# EAGLE design cp_watch_rev_B (EAGLE 9.1.0)
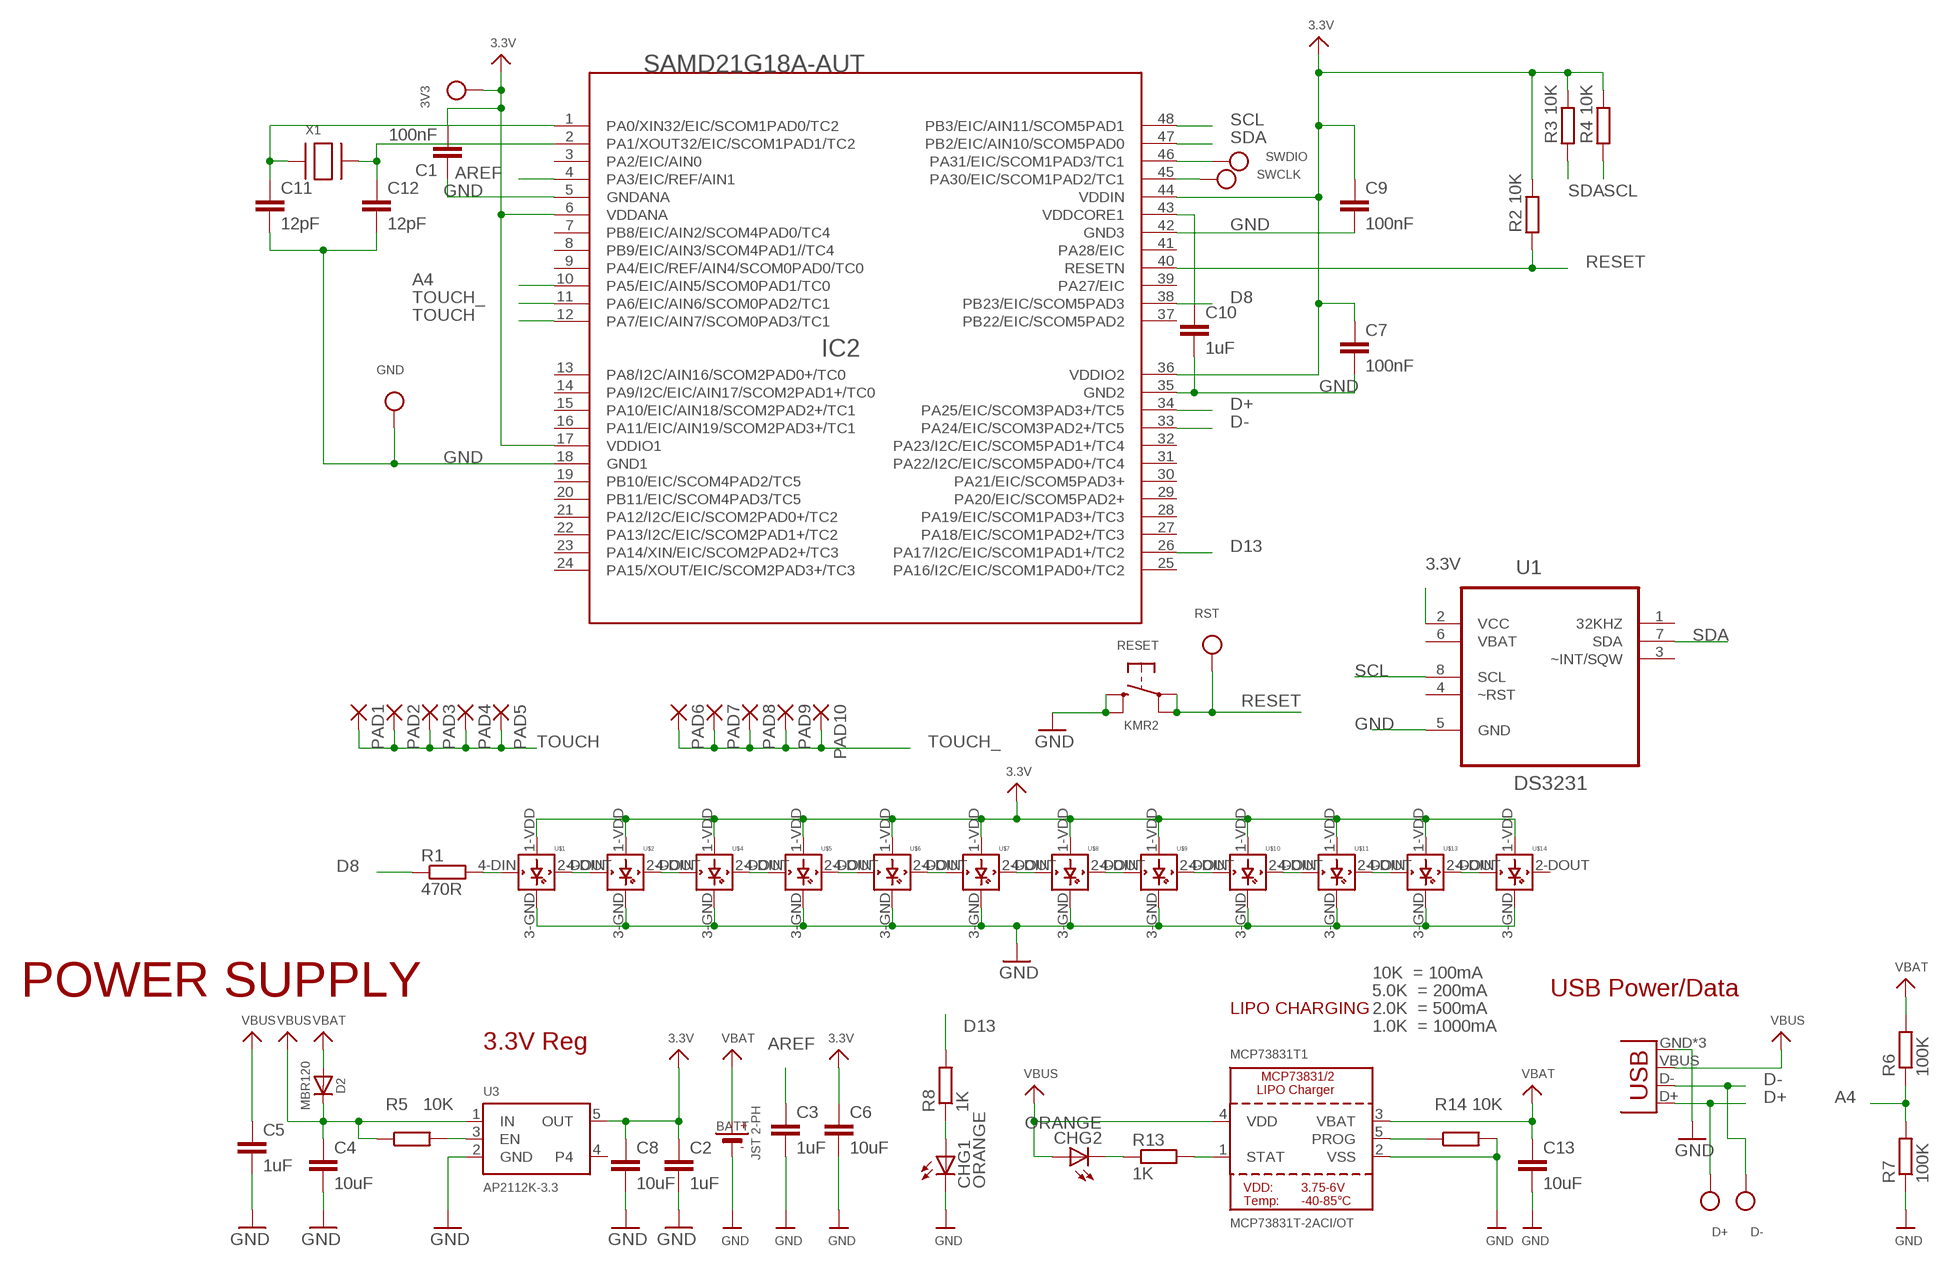
[diagram p0: schematic, sheet 1]

## Parts
3V3  TESTPOINTROUND1MM  [TESTPOINT_ROUND_1MM]
BATT  JST 2-PH  BATTERY  [JSTPH2]
C1  100nF  C-EUC0805  [C0805]
C2  1uF  C-EUC0805  [C0805]
C3  1uF  C-EUC0805  [C0805]
C4  10uF  C-EUC0805  [C0805]
C5  1uF  C-EUC0805  [C0805]
C6  10uF  C-EUC0805  [C0805]
C7  100nF  C-EUC0805  [C0805]
C8  10uF  C-EUC0805  [C0805]
C9  100nF  C-EUC0805  [C0805]
C10  1uF  C-EUC0805  [C0805]
C11  12pF  C-EUC0805  [C0805]
C12  12pF  C-EUC0805  [C0805]
C13  10uF  C-EUC0805  [C0805]
CHG1  ORANGE  LEDCHIPLED_0805  [CHIPLED_0805]
CHG2  ORANGE  LEDCHIPLED_0805  [CHIPLED_0805]
D2  MBR120  DIODESOD-123  [SOD-123]
D+  TESTPOINTROUND1MM  [TESTPOINT_ROUND_1MM]
D-  TESTPOINTROUND1MM  [TESTPOINT_ROUND_1MM]
GND  TESTPOINTROUND1MM  [TESTPOINT_ROUND_1MM]
IC2  SAMD21G18A-AUT  SAMD21G18A  [TQFP48]
MCP73831T1  MCP73831T-2ACI/OT  MCP73831/2  [SOT23-5]
PAD1  SMD5  [SMD2,54-5,08]
PAD2  SMD5  [SMD2,54-5,08]
PAD3  SMD5  [SMD2,54-5,08]
PAD4  SMD5  [SMD2,54-5,08]
PAD5  SMD5  [SMD2,54-5,08]
PAD6  SMD5  [SMD2,54-5,08]
PAD7  SMD5  [SMD2,54-5,08]
PAD8  SMD5  [SMD2,54-5,08]
PAD9  SMD5  [SMD2,54-5,08]
PAD10  SMD5  [SMD2,54-5,08]
R1  470R  R-EU_R0805  [R0805]
R2  10K  R-EU_R0805  [R0805]
R3  10K  R-EU_R0805  [R0805]
R4  10K  R-EU_R0805  [R0805]
R5  10K  R-EU_R0805  [R0805]
R6  100K  R-EU_R0805  [R0805]
R7  100K  R-EU_R0805  [R0805]
R8  1K  R-EU_R0805  [R0805]
R13  1K  R-EU_R0805  [R0805]
R14  10K  R-EU_R0805  [R0805]
RESET  KMR2  SWITCH_TACT_SMT4.6X2.8  [BTN_KMR2_4.6X2.8]
RST  TESTPOINTROUND1MM  [TESTPOINT_ROUND_1MM]
SWCLK  TESTPOINTROUND1MM  [TESTPOINT_ROUND_1MM]
SWDIO  TESTPOINTROUND1MM  [TESTPOINT_ROUND_1MM]
U1  DS3231  DS3231MZ+  [SOIC8_150MIL]
U3  AP2112K-3.3  AP2112K-3.3_  [SOT95P290X120-5]
U$1  WS2812B  [WS2812B]
U$2  WS2812B  [WS2812B]
U$4  WS2812B  [WS2812B]
U$5  WS2812B  [WS2812B]
U$6  WS2812B  [WS2812B]
U$7  WS2812B  [WS2812B]
U$8  WS2812B  [WS2812B]
U$9  WS2812B  [WS2812B]
U$10  WS2812B  [WS2812B]
U$11  WS2812B  [WS2812B]
U$13  WS2812B  [WS2812B]
U$14  WS2812B  [WS2812B]
USB  USB_MICRO_ATTEND_  [USB_MICRO]
X1  XTALNX5032  [NX5032]

## Nets
3.3V: 3V3.P$1 C1.2 C2.1 C6.1 C7.1 C8.1 C9.1 IC2.6(VDDANA) IC2.17(VDDIO1) IC2.36(VDDIO2) IC2.44(VDDIN) R2.2 R3.2 R4.2 U1.2(VCC) U3.5(OUT) U$1.1-VDD(VDD) U$2.1-VDD(VDD) U$4.1-VDD(VDD) U$5.1-VDD(VDD) U$6.1-VDD(VDD) U$7.1-VDD(VDD) U$8.1-VDD(VDD) U$9.1-VDD(VDD) U$10.1-VDD(VDD) U$11.1-VDD(VDD) U$13.1-VDD(VDD) U$14.1-VDD(VDD)
A4: IC2.10(PA5/EIC/AIN5/SCOM0PAD1/TC0) R6.1 R7.2
AREF: C3.1 IC2.4(PA3/EIC/REF/AIN1)
D8: IC2.38(PB23/EIC/SCOM5PAD3) R1.1
D13: IC2.26(PA17/I2C/EIC/SCOM1PAD1+/TC2) R8.2
D+: D+.P$1 IC2.34(PA25/EIC/SCOM3PAD3+/TC5) USB.D+
D-: D-.P$1 IC2.33(PA24/EIC/SCOM3PAD2+/TC5) USB.D-
GND: BATT.1(-) C1.1 C2.2 C3.2 C4.2 C5.2 C6.2 C7.2 C8.2 C9.2 C10.2 C11.2 C12.2 C13.2 CHG1.C GND.P$1 IC2.5(GNDANA) IC2.18(GND1) IC2.35(GND2) IC2.42(GND3) MCP73831T1.2(VSS) R7.1 R14.2 RESET.B'(S1) RESET.B(S) U1.5(GND) U3.2(GND) U$1.3-GND(GND) U$2.3-GND(GND) U$4.3-GND(GND) U$5.3-GND(GND) U$6.3-GND(GND) U$7.3-GND(GND) U$8.3-GND(GND) U$9.3-GND(GND) U$10.3-GND(GND) U$11.3-GND(GND) U$13.3-GND(GND) U$14.3-GND(GND) USB.GND USB.GND@2(GND) USB.GND@3(GND)
N$1: C11.1 IC2.1(PA0/XIN32/EIC/SCOM1PAD0/TC2) X1.P$1
N$2: IC2.45(PA30/EIC/SCOM1PAD2/TC1) SWCLK.P$1
N$3: R5.2 U3.3(EN)
N$4: R1.2 U$1.4-DIN(DIN)
N$5: C10.1 IC2.43(VDDCORE1)
N$6: U$1.2-DOUT(DOUT) U$2.4-DIN(DIN)
N$7: C12.1 IC2.2(PA1/XOUT32/EIC/SCOM1PAD1/TC2) X1.P$2
N$8: U$2.2-DOUT(DOUT) U$4.4-DIN(DIN)
N$9: U$4.2-DOUT(DOUT) U$5.4-DIN(DIN)
N$10: U$5.2-DOUT(DOUT) U$6.4-DIN(DIN)
N$11: U$6.2-DOUT(DOUT) U$7.4-DIN(DIN)
N$12: U$7.2-DOUT(DOUT) U$8.4-DIN(DIN)
N$13: U$8.2-DOUT(DOUT) U$9.4-DIN(DIN)
N$14: U$9.2-DOUT(DOUT) U$10.4-DIN(DIN)
N$15: U$10.2-DOUT(DOUT) U$11.4-DIN(DIN)
N$16: U$11.2-DOUT(DOUT) U$13.4-DIN(DIN)
N$17: U$13.2-DOUT(DOUT) U$14.4-DIN(DIN)
N$18: CHG1.A R8.1
N$23: CHG2.C R13.1
N$27: MCP73831T1.1(STAT) R13.2
N$28: MCP73831T1.5(PROG) R14.1
RESET: IC2.40(RESETN) R2.1 RESET.A'(P1) RESET.A(P) RST.P$1
SCL: IC2.48(PB3/EIC/AIN11/SCOM5PAD1) R4.1 U1.8(SCL)
SDA: IC2.47(PB2/EIC/AIN10/SCOM5PAD0) R3.1 U1.7(SDA)
SWDIO: IC2.46(PA31/EIC/SCOM1PAD3/TC1) SWDIO.P$1
TOUCH: IC2.12(PA7/EIC/AIN7/SCOM0PAD3/TC1) PAD1.1(P) PAD2.1(P) PAD3.1(P) PAD4.1(P) PAD5.1(P)
TOUCH_: IC2.11(PA6/EIC/AIN6/SCOM0PAD2/TC1) PAD6.1(P) PAD7.1(P) PAD8.1(P) PAD9.1(P) PAD10.1(P)
VBAT: BATT.2(+) C13.1 D2.A MCP73831T1.3(VBAT) R6.2
VBUS: C4.1 C5.1 CHG2.A D2.C MCP73831T1.4(VDD) R5.1 U3.1(IN) USB.VBUS
Unconnected: IC2.3(PA2/EIC/AIN0) IC2.7(PB8/EIC/AIN2/SCOM4PAD0/TC4) IC2.8(PB9/EIC/AIN3/SCOM4PAD1//TC4) IC2.9(PA4/EIC/REF/AIN4/SCOM0PAD0/TC0) IC2.13(PA8/I2C/AIN16/SCOM2PAD0+/TC0) IC2.14(PA9/I2C/EIC/AIN17/SCOM2PAD1+/TC0) IC2.15(PA10/EIC/AIN18/SCOM2PAD2+/TC1) IC2.16(PA11/EIC/AIN19/SCOM2PAD3+/TC1) IC2.19(PB10/EIC/SCOM4PAD2/TC5) IC2.20(PB11/EIC/SCOM4PAD3/TC5) IC2.21(PA12/I2C/EIC/SCOM2PAD0+/TC2) IC2.22(PA13/I2C/EIC/SCOM2PAD1+/TC2) IC2.23(PA14/XIN/EIC/SCOM2PAD2+/TC3) IC2.24(PA15/XOUT/EIC/SCOM2PAD3+/TC3) IC2.25(PA16/I2C/EIC/SCOM1PAD0+/TC2) IC2.27(PA18/EIC/SCOM1PAD2+/TC3) IC2.28(PA19/EIC/SCOM1PAD3+/TC3) IC2.29(PA20/EIC/SCOM5PAD2+) IC2.30(PA21/EIC/SCOM5PAD3+) IC2.31(PA22/I2C/EIC/SCOM5PAD0+/TC4) IC2.32(PA23/I2C/EIC/SCOM5PAD1+/TC4) IC2.37(PB22/EIC/SCOM5PAD2) IC2.39(PA27/EIC) IC2.41(PA28/EIC) U1.1(32KHZ) U1.3(~INT/SQW) U1.4(~RST) U3.4 U$14.2-DOUT(DOUT)

## Notes on the sheet
- 10K  = 100mA
- POWER SUPPLY | 5.0K  = 200mA | USB Power/Data
- LIPO CHARGING | 2.0K  = 500mA
- 1.0K  = 1000mA
- 3.3V Reg

## Power pins joined to a net without a drawn wire
VBAT: U1.6(VBAT)

## Library data of the parts
3V3 D+ D- GND RST SWCLK SWDIO = microbuilder:TESTPOINT: Test Point Various test points for characterisation and PCB testing TESTPOINT_SMT - Compact Surface Mount Test Point [Digikey: 5016KTR-ND]
BATT = microbuilder:BATTERY: CR1220 SMT - Digikey: 3001K-ND
C1-C13 = rcl:C-EU: CAPACITOR, European symbol; SPICEPREFIX: C
CHG1 CHG2 = led:LED: LED OSRAM: - CHIPLED LG R971, LG N971, LY N971, LG Q971, LY Q971, LO R971, LY R971 LH N974, LH R974 LS Q976, LO Q976, LY Q976 LO Q996 - Hyper CHIPLED LW Q18S LB Q993, LB Q99A, LB R99A - SideLED LS A670, LO A670, LY A670, LG A670, LP A670 LB A673, LV A673, LT A673, LW A673 LH A674 LY A675 LS A676, LA A676, LO A676, LY A676, LW A676 LS A679, LY A679, LG A679 - Hyper Micro SIDELED® LS Y876, LA Y876, LO Y876, LY Y876 LT Y87S - SmartLED LW L88C, LW L88S LB L89C, LB L89S, LG L890 LS L89K, LO L89K, LY L89K LS L896, LA L896, LO L896, LY L896 - TOPLED LS T670, LO T670, LY T670, LG T670, LP T670 LSG T670, LSP T670, LSY T670, LOP T670, LYG T670 LG T671, LOG T671, LSG T671 LB T673, LV T673, LT T673, LW T673 LH T674 LS T676, LA T676, LO T676, LY T676, LB T676, LH T676, LSB T676, LW T676 LB T67C, LV T67C, LT T67C, LS T67K, LO T67K, LY T67K, LW E67C LS E67B, LA E67B, LO E67B, LY E67B, LB E67C, LV E67C, LT E67C LW T67C LS T679, LY T679, LG T679 LS T770, LO T770, LY T770, LG T770, LP T770 LB T773, LV T773, LT T773, LW T773 LH T774 LS E675, LA E675, LY E675, LS T675 LS T776, LA T776, LO T776, LY T776, LB T776 LHGB T686 LT T68C, LB T68C - Hyper Mini TOPLED® LB M676 - Mini TOPLED Santana® LG M470 LS M47K, LO M47K, LY M47K Source: http://www.osram.convergy.de LUXEON: - LUMILED® LXK2-PW12-R00, LXK2-PW12-S00, LXK2-PW14-U00, LXK2-PW14-V00 LXK2-PM12-R00, LXK2-PM12-S00, LXK2-PM14-U00 LXK2-PE12-Q00, LXK2-PE12-R00, LXK2-PE12-S00, LXK2-PE14-T00, LXK2-PE14-U00 LXK2-PB12-K00, LXK2-PB12-L00, LXK2-PB12-M00, LXK2-PB14-N00, LXK2-PB14-P00, LXK2-PB14-Q00 LXK2-PR12-L00, LXK2-PR12-M00, LXK2-PR14-Q00, LXK2-PR14-R00 LXK2-PD12-Q00, LXK2-PD12-R00, LXK2-PD12-S00 LXK2-PH12-R00, LXK2-PH12-S00 LXK2-PL12-P00, LXK2-PL12-Q00, LXK2-PL12-R00 Source: www.luxeon.com KINGBRIGHT: KA-3528ASYC Source: www.kingbright.com
D2 = microbuilder:DIODE: Diode SMA Model Volts Amps Type Vf Ir Digikey # Notes SSA34-E3 40V 3A Schottky 480mV @ 3A 200uA @ 40V SSA34-E3/61TGITR-ND CDBA120-G 20V 1A Schottky 500mV @ 1A 500uA @ 20V 641-1014-6-ND REEL MBRA210 10V 2A Schottky 350mV @ 2A 700uA @ 10V MBRA210LT3 SOD-123 Model Volts Amps Type Vf Ir Order # Notes BAT54T1G 30V 200mA Schottky 800mV @ 200mA 2uA @ 25V BAT54T1GOSTR-ND B0530W 30V 500mA Schottky 430mV @ 500mA 130uA @ 30V B0530W-FDICT-ND REEL MBR120 20V 1A Schottky 340mV @ 1A MBR120VLSFT1GOSCT-ND SOD-323 Model Volts Amps Type Vf Ir Order # Notes PMEG2005EJ 20V 500mA Schottky 355mV @ 500mA 568-4110-1-ND ZLLS410 10V 570mA Schottky 380mV @ 570mA ZLLS410CT-ND 1N4148WS 75V 150mA Silicon/Simple 1V 1N4148WSFSCT-ND REEL SOD-523 Model Volts Amps Type Vf Ir Order # Notes BAT54XV2 30V 200mA Schottky 0.8V @ 100mA BAT54XV2CT-ND TB751S 30V 30mA Schottky RB751S-40TE61CT-ND SOT23-R/W (R = Solder Paste/Reflow Ovens, W = Hand-Soldering) Model Volts Amps Type Vf Ir Order # Notes BAT54FILM 40V 300mA Schottky 497-7162-1-ND POWERDI-5 Model Volts Amps Type Vf Ir Order # Notes PDS560 60V 5A Schottky 670mV @ 5A 150uA @ 60V PDS560DICT-ND
IC2 = Arduino:SAMD21G18A: Atmel D21 32bit ARM Cortex-M0 microcontroller - 48 PIN TQFP 256KB flash memory + 32KB SRAM
MCP73831T1 = microbuilder:MCP73831/2: MCP73831/2 LIPO Charger VDD: 3.75 - 6V Temp -40 - 85°C Programmable Charge Rate: 15-500mA NOTE: STAT is a tri-state logic output on the MCP73831 and an open-drain output on the MCP73832. SOT23-5 with 4.2V output and tri-state logic on STAT = MCP73831T-2ACI/OT
PAD1-PAD10 = wirepad:SMD5: SMD PAD
R1-R8 R13 R14 = rcl:R-EU_: RESISTOR, European symbol; SPICEPREFIX: R
RESET = microbuilder:SWITCH_TACT_SMT: SMT Tact Switches 6x6mm - Digikey: P12940SCT-ND KMR2 (4.6x2.8mm) - Digikey: 401-1426-1-ND EVQ-PQHB55 - Light Touch, 160GF (4.5x4.5mm) - Digikey: P8090SCT-ND KMT0 - KMT021 NGJ LHS (etc.) IP68/Waterproof - Digikey: CKN10289CT-ND
U1 = zak:DS3231MZ+
U3 = dronecz:AP2112K-3.3
U$1 U$2 U$4-U$11 U$13 U$14 = dronecz:WS2812B
USB = dronecz:USB_MICRO_ATTEND: https://www.tme.eu/cz/Document/1cbb1fe1d020818ecbe0fffe16726397/207A-BBA0-R.pdf
X1 = adafruit:XTAL: Low cost SMT crystals, no capacitors included http://www.ladyada.net/library/eagle

## Net classes
1 vcc: width 0.203 mm, drill 0.356 mm, clearance 0.203 mm
2 GND: width 0.203 mm, drill 0.356 mm, clearance 0.203 mm

## Board
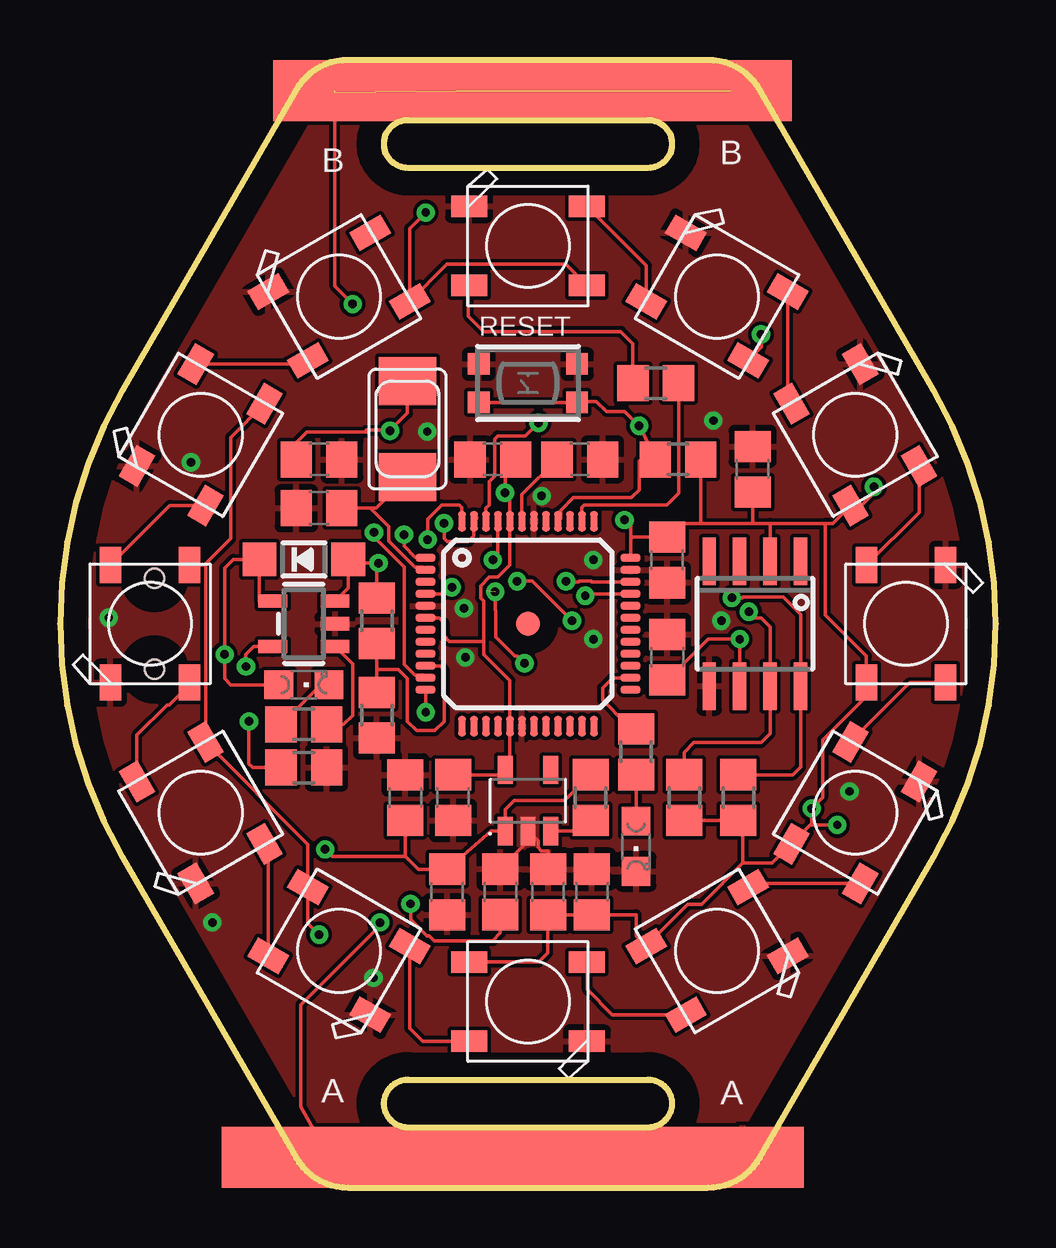
[diagram p1: board, top side]
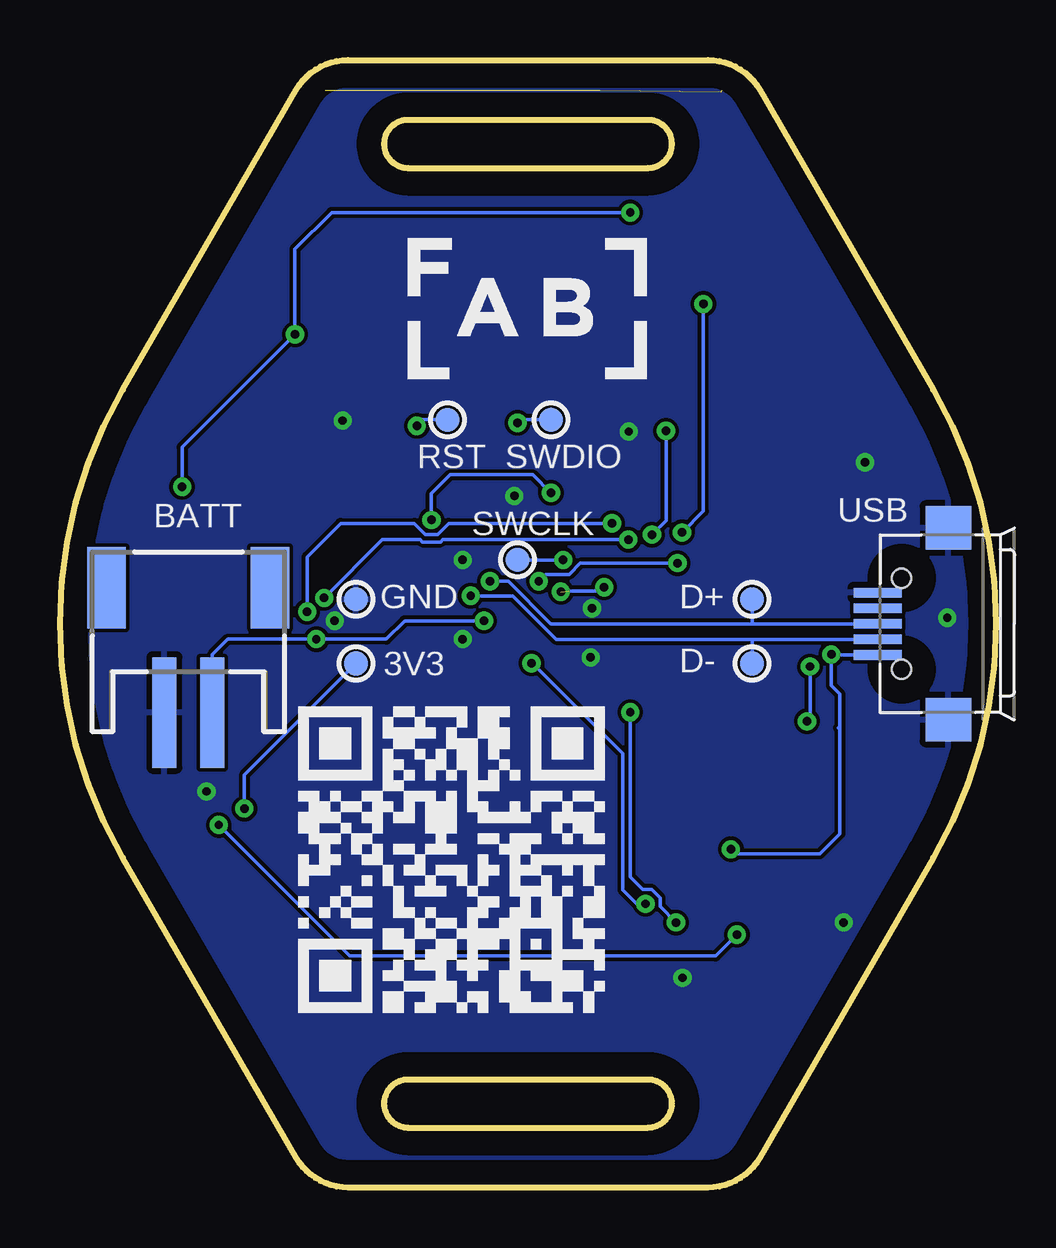
[diagram p2: board, bottom side, seen from below]

Size 39 x 47 mm. Coordinates in mm from the lower left corner, seen from the top.
Outline: 12,47 arc60 9.83,45.75 2.62,33.26 arc60 2.62,13.74 9.83,1.25 arc60 12,0 27,0 arc60 29.16,1.25 36.38,13.74 arc60 36.38,33.26 29.16,45.75 arc60 27,47 12,47
Outline: 24.5,42.5 14.5,42.5 arc-180 14.5,44.5 24.5,44.5 arc-180 24.5,42.5
Outline: 24.5,4.5 arc-180 24.5,2.5 14.5,2.5 arc-180 14.5,4.5 24.5,4.5
Copper layers (1*16): Top 0.035mm / dielectric 1.5mm / Bottom 0.035mm
Design rules "default": minimum track width 6mil, minimum drill 0.35mm, track to track 6mil, track to pad 6mil, pad to pad 6mil, via to via 6mil, smd to smd 6mil, copper to edge 40mil, drill to drill 6mil, minimum pad ring 10mil, minimum via ring 8mil, stop-mask expansion 4mil, vias tented up to drill 0mil, thermal gap 10mil

### Footprints (pad centres in the part's own frame; a part is rotated, then mirrored left to right if it is on the bottom)
TESTPOINT_ROUND_1MM = smd 1 x 1: P$1 0,0
JSTPH2 = smd 1 x 4.6: 1 -1,-3.7; 2 1,-3.7 | smd 1.6 x 3.4: NC1 -3.4,1.5; NC2 3.4,1.5
C0805 = smd 1.3 x 1.5: 1 -0.95,0; 2 0.95,0
CHIPLED_0805 = smd 1.2 x 1.2: A 0,-1.05; C 0,1.05
SOD-123 = smd 1.4 x 1.4: A 1.85,0; C -1.85,0
TQFP48 = smd 0.85 x 0.32: 1 -4.275,2.75; 2 -4.275,2.25; 3 -4.275,1.75; 4 -4.275,1.25; 5 -4.275,0.75; 6 -4.275,0.25; 7 -4.275,-0.25; 8 -4.275,-0.75; 9 -4.275,-1.25; 10 -4.275,-1.75; 11 -4.275,-2.25; 12 -4.275,-2.75; 25 4.275,-2.75; 26 4.275,-2.25; 27 4.275,-1.75; 28 4.275,-1.25; 29 4.275,-0.75; 30 4.275,-0.25; 31 4.275,0.25; 32 4.275,0.75; 33 4.275,1.25; 34 4.275,1.75; 35 4.275,2.25; 36 4.275,2.75 | smd 0.32 x 0.85: 13 -2.75,-4.275; 14 -2.25,-4.275; 15 -1.75,-4.275; 16 -1.25,-4.275; 17 -0.75,-4.275; 18 -0.25,-4.275; 19 0.25,-4.275; 20 0.75,-4.275; 21 1.25,-4.275; 22 1.75,-4.275; 23 2.25,-4.275; 24 2.75,-4.275; 37 2.75,4.275; 38 2.25,4.275; 39 1.75,4.275; 40 1.25,4.275; 41 0.75,4.275; 42 0.25,4.275; 43 -0.25,4.275; 44 -0.75,4.275; 45 -1.25,4.275; 46 -1.75,4.275; 47 -2.25,4.275; 48 -2.75,4.275 | smd 1 x 1: P$1 0,0
SOT23-5 = smd 0.55 x 1.2: 1 -0.95,-1.3; 2 0,-1.3; 3 0.95,-1.3; 4 0.95,1.3; 5 -0.95,1.3
SMD2,54-5,08 = smd 2.54 x 5.08: 1 0,0
R0805 = smd 1.3 x 1.5: 1 -0.95,0; 2 0.95,0
BTN_KMR2_4.6X2.8 = smd 0.9 x 0.9: A 2.05,0.8; A' -2.05,0.8; B 2.05,-0.8; B' -2.05,-0.8
SOIC8_150MIL = smd 0.559 x 1.981: 1 -1.905,-2.6; 2 -0.635,-2.6; 3 0.635,-2.6; 4 1.905,-2.6; 5 1.905,2.6; 6 0.635,2.6; 7 -0.635,2.6; 8 -1.905,2.6
SOT95P290X120-5 = smd 1.18 x 0.609: 1 -1.274,0.95; 2 -1.274,0; 3 -1.274,-0.95; 4 1.274,-0.95; 5 1.274,0.95
WS2812B = smd 1.5 x 0.9: 1-VDD 2.45,-1.65; 2-DOUT 2.45,1.65; 3-GND -2.45,1.65; 4-DIN -2.45,-1.65
USB_MICRO = smd 0.4 x 2: D+ 0,3.1; D- -0.65,3.1; GND 1.3,3.1; ID 0.65,3.1; VBUS -1.3,3.1 | smd 1.8 x 1.9: GND@2 -4,0.15; GND@3 4,0.15 | hole 0.8: -1.9,2.1; 1.9,2.1
NX5032 = smd 2 x 2.4: P$1 2,0; P$2 -2,0

### Placement (x,y rotation side)
3V3  26.67,21.84 0 bottom
BATT  33.65,23.5 0 bottom
C1  16.38,16.26 90 top
C2  28.86,29.94 90 top
C3  18.35,12.32 90 top
C4  16.13,12.32 270 top
C5  14.39,16.25 90 top
C6  20.34,12.32 90 top
C7  25.29,26.16 270 top
C8  22.16,12.32 90 top
C9  18.03,30.35 180 top
C10  21.66,30.35 0 top
C11  10.79,30.35 0 top
C12  10.79,28.32 180 top
C13  25.3,22.1 90 top
CHG1  24,14.22 180 top
CHG2  10.16,20.95 270 top
D2  10.16,26.18 0 top
D+  10.16,24.51 0 bottom
D-  10.16,21.84 0 bottom
GND  26.67,24.51 0 bottom
IC2  19.5,23.5 0 top
MCP73831T1  10.16,23.5 90 top
PAD1  9.27,1.27 270 top
PAD2  14.35,1.27 90 top
PAD3  23.37,1.27 90 top
PAD4  28.45,1.27 90 top
PAD5  18.41,1.27 90 top
PAD6  27.94,45.72 90 top
PAD7  24.13,45.72 90 top
PAD8  20.32,45.72 90 top
PAD9  16.51,45.72 90 top
PAD10  11.43,45.72 90 top
R1  24.82,33.53 180 top
R2  25.75,30.35 0 top
R3  26.01,16.26 270 top
R4  28.27,16.26 270 top
R5  22.11,16.26 270 top
R6  13.21,23.62 90 top
R7  13.21,19.68 90 top
R8  24,18.16 90 top
R13  10.16,19.3 0 top
R14  10.16,17.5 0 top
RESET  19.5,33.53 180 top
RST  22.86,32 0 bottom
SWCLK  19.94,26.16 0 bottom
SWDIO  18.54,32 0 bottom
U1  28.96,23.5 180 top
U3  19.5,16.13 90 top
U$1  19.5,39.25 0 top
U$2  27.37,37.14 330 top
U$4  33.14,31.37 300 top
U$5  35.25,23.5 270 top
U$6  33.14,15.63 240 top
U$7  27.37,9.86 210 top
U$8  19.5,7.75 180 top
U$9  11.63,9.86 150 top
U$10  5.86,15.63 120 top
U$11  3.75,23.5 90 top
U$13  5.86,31.37 60 top
U$14  11.63,37.14 30 top
USB  1.83,23.5 90 bottom
X1  14.48,31.62 90 top

### Tracks (layer width: path | path; a pad name or v marks a point on that pad's centre or on a via)
3.3V  (via drill 0.35)
  Top 0.152: 24.36,10.13 24,10.49 24,11.37 C8.1 C6.1 20.46,11.37 20.32,11.37 | 24.36,10.13 U$7.1-VDD | 31.88,27.69 32.19,27.69 U$4.1-VDD 33.38,28.43 33.91,28.96 v33.91,29.21 | 31.88,27.69 31.88,23.87 33.6,22.15 U$5.1-VDD 33.6,20.47 31.78,18.65 31.78,16.26 v31.32,15.8 31.32,15.16 31.27,15.11 | U$7.1-VDD | U$11.1-VDD 6.01,25.95 6.07,26 | 6.07,26 7.11,27.05 7.11,31.27 U$13.1-VDD | 6.07,26 6.07,21.91 6.08,21.89 6.08,20.2 6.07,20.19 U$10.1-VDD 10.33,14.31 U$9.1-VDD 10.33,11.01 v10.79,10.54 | 22.22,37.33 U$1.1-VDD 21.07,38.48 16.12,38.48 U$14.1-VDD 14.57,39.97 v15.24,40.64 | 24.64,27.11 C7.1 | C7.1 23.86,27.11 23.79,27.05 23.77,27.05 | C7.1 25.87,27.69 26.67,27.69 | 26.67,27.69 28.82,27.69 | 28.82,27.69 29.59,27.69 | 29.59,27.69 31.88,27.69 | U1.2 29.59,27.69 | U$2.1-VDD 29.21,35.02 v29.21,35.56 | 31.27,15.11 U$6.1-VDD 29.68,13.53 28.44,13.53 | 20.26,11.37 20.32,11.37 | 28.44,13.53 26.73,11.81 26.16,11.81 U$7.1-VDD | C1.2 18.35,17.21 U3.5 18.75,17.6 IC2.17 18.75,21.13 17.65,22.23 17.65,22.77 | IC2.36 23.77,27.05 | 23.77,27.05 23.77,27.57 v23.52,27.83 | C9.1 18.54,29.91 v18.54,28.96 18.75,28.75 IC2.44 18.75,25.95 18.23,25.44 17.88,25.44 17.53,25.08 17.53,24.58 17.65,24.45 17.65,22.77 | 28.44,13.53 28.44,15.13 R4.2 R3.2 | 24.38,10.16 24.36,10.13 | v32.38,15.11 31.27,15.11 | IC2.6 15.79,23.75 16,23.54 16,22.99 16.22,22.77 17.65,22.77 | U$8.1-VDD 19.94,9.4 20.32,9.78 20.32,11.37 | R2.2 26.7,27.71 26.67,27.69 | C2.1 28.86,27.73 28.82,27.69
  Bottom 0.152: v33.91,29.21 33.91,30.86 v29.21,35.56 29.21,39.12 27.69,40.64 v15.24,40.64 | v31.32,15.8 31.32,17.19 3V3.P$1 | v10.79,10.54 11.68,9.65 26.92,9.65 v32.38,15.11 | v23.52,27.83 23.52,28.93 22.73,29.72 19.3,29.72 v18.54,28.96
A4
  Top 0.152: IC2.10 15.84,21.75 16,21.59 16,19.43 15.62,19.05 14.86,19.05 14.48,19.43 14.48,21.21 14.1,21.59 13.21,21.59 | 13.21,21.59 R6.1 | R7.2 13.21,21.59
AREF  (via drill 0.35)  (1 unrouted)
  Top 0.152: C3.1 18.35,10.61 18.03,10.29 15.59,10.29 15.39,10.49 15.28,10.49 14.6,11.17 v14.6,11.82 | IC2.4 16.06,24.75 v16.33,25.02 | v19.36,21.85 19.05,22.15 18.94,22.15 18.15,22.94 18.15,24.06 18.13,24.08 v18.13,24.83
  Bottom 0.152: v19.36,21.85 19.31,21.85 15.54,18.09 15.54,12.4 14.97,11.82 v14.6,11.82 | 17.81,24.86 16.49,24.86 v16.33,25.02
D8
  Top 0.152: IC2.38 21.75,28.35 21.84,28.45 25.27,28.45 25.78,28.96 R1.1
D13
  Top 0.152: R8.2 23.56,19.36 22.61,20.32 22.61,20.83 23.03,21.25 IC2.26
D+  (via drill 0.35)
  Top 0.152: v21.08,25.27 21.1,25.25 21.61,25.25 21.64,25.27 22.14,25.27 22.16,25.25 IC2.34
  Bottom 0.152: USB.D+ 10.16,23.5 | 10.16,23.5 18.55,23.5 20.32,25.27 v21.08,25.27 | D+.P$1 10.16,23.5
D-  (via drill 0.35)
  Top 0.152: IC2.33 21.97,24.75 v21.89,24.67
  Bottom 0.152: USB.D- 10.16,22.85 | 10.16,22.85 18.33,22.85 20.14,24.67 v21.89,24.67 | D-.P$1 10.16,22.85
GND  (via drill 0.35)
  Top 0.152: C6.2 20.34,14.02 20.32,14.04 20.05,14.04 19.92,14.17 19.92,14.44 U3.2 19.5,14.42 C3.2
  other vias: 22.22,22.86 32.89,16.51 27.22,31.97 5.46,30.23 16.84,24.15 15.3,31.51 2.03,23.75 16.89,22.1 20.07,28.83 27.56,23.62 22.22,26.16 6.35,11.05 13.06,8.74
  pour Top (rank 2): 0,0 39.37,0 39.37,46.99 0,46.99
  pour Bottom (rank 2): 0,0 39.37,0 39.37,46.99 0,46.5
N$1  (via drill 0.35)
  Top 0.152: 14.45,33.66 X1.P$1 14.48,32.27 v13.75,31.54 13.82,31.57 12.77,31.57 12.7,31.5 | 12.7,31.5 10.29,31.5 9.84,31.05 C11.1 | 12.7,31.5 12.83,31.5 | IC2.1 15.19,26.29 14.78,26.29 14.34,26.74 v14.34,27.21
  Bottom 0.152: v14.34,27.21 13.75,27.8 v13.75,31.54
N$2  (via drill 0.35)
  Top 0.152: v18.03,26.16 18.25,26.38 IC2.45
  Bottom 0.152: SWCLK.P$1 v18.03,26.16
N$3
  Top 0.152: U3.3 21.66,14.85 R5.2
N$4
  Top 0.152: R1.2 23.87,35.18 23.37,35.69 17.65,35.69 17.02,36.32 17.02,37.57 U$1.4-DIN
N$5
  Top 0.152: 20.83,29.84 20.71,29.96 C10.1 19.25,28.89 IC2.43 19.25,27.94
N$6
  Top 0.152: U$2.4-DIN 24.43,38.42 U$1.2-DOUT
N$7
  Top 0.152: IC2.2 15.11,25.86 14.78,25.86 13.69,26.95 13.69,27.56 12.92,28.32 | 12.92,28.32 11.94,28.32 C12.1 | X1.P$2 13.18,28.32 12.92,28.32
N$8
  Top 0.152: U$4.4-DIN 30.32,32.83 U$2.2-DOUT
N$9
  Top 0.152: U$5.4-DIN 35.79,28.14 U$4.2-DOUT
N$10
  Top 0.152: U$6.4-DIN 35.41,21.05 U$5.2-DOUT
N$11
  Top 0.152: U$7.4-DIN 28.83,12.68 U$6.2-DOUT
N$12
  Top 0.152: U$7.2-DOUT 23.02,7.21 21.97,8.26 21.97,9.38 U$8.4-DIN
N$13
  Top 0.152: U$8.2-DOUT 15.11,6.1 14.57,6.64 U$9.4-DIN
N$14
  Top 0.152: U$9.2-DOUT 8.68,14.17 U$10.4-DIN
N$15
  Top 0.152: U$10.2-DOUT 3.21,18.86 4.46,20.11 4.55,20.11 5.4,20.96 U$11.4-DIN 5.08,21.37 5.08,21.59
N$16
  Top 0.152: U$11.2-DOUT 4.58,28.43 U$13.4-DIN
N$17
  Top 0.152: U$14.4-DIN 10.17,34.32 U$13.2-DOUT
N$18
  Top 0.152: R8.1 CHG1.A
N$23
  Top 0.152: R13.1 10.86,20.95 CHG2.C
N$27
  Top 0.152: R13.2 11.81,19.3 12.19,19.68 12.19,21.82 MCP73831T1.1
N$28  (via drill 0.35)
  Top 0.152: 8.86,22.34 MCP73831T1.5 8.07,22.55 7.75,22.23 v7.75,21.72 | 8.02,19.28 8,19.3 | 8,19.3 v7.87,19.43 | R14.1 8.02,17.5 7.87,17.65 7.87,19.18 8,19.3
  Bottom 0.152: v7.87,19.43 7.75,19.56 v7.75,21.72
RESET  (via drill 0.35)
  Top 0.152: RESET.A RESET.A' | RESET.A' 21.59,32.35 | IC2.40 20.86,27.89 20.86,28.22 21.39,28.75 23.8,28.75 24.13,29.08 24.13,30.28 R2.1 24.2,31.68 v24.13,31.75 23.53,32.35 22.77,32.35 22.35,32.77 21.59,32.77 RESET.A'
  Bottom 0.152: RST.P$1 23.88,32 v24.13,31.75
SCL  (via drill 0.35)
  Top 0.152: v27.99,24.58 28.42,24.58 28.45,24.61 30.13,24.61 30.86,23.88 30.86,20.95 U1.8 30.86,17.53 30.54,17.21 R4.1 | IC2.48 16.75,28.34 16.64,28.45 15.91,28.45 15.32,27.86 v15.32,27.01
  Bottom 0.152: 15.45,26.97 v15.32,27.01 23.05,27.01 23.14,26.92 23.9,26.92 23.99,27.01 25.57,27.01 v27.99,24.58
SDA  (via drill 0.35)
  Top 0.152: v28.7,24 28.96,23.75 29.21,23.75 29.59,23.37 U1.7 29.59,18.92 29.21,18.54 26.42,18.54 26.01,18.14 R3.1 | 17.36,27.94 17.36,27.89 IC2.47 17.25,27.16 17.02,26.92 16.13,26.92 16,27.05 v16,27.69
  Bottom 0.152: v28.7,24 28.7,26.29 27.3,27.69 24.24,27.69 23.77,27.22 23.27,27.22 22.8,27.69 v16,27.69
SWDIO  (via drill 0.35)
  Top 0.152: IC2.46 17.75,28.32 17.88,28.45 17.88,29.42 18.1,29.65 18.1,31.19 18.24,31.33 19.39,31.33 v19.94,31.88
  Bottom 0.152: SWDIO.P$1 19.56,32 19.68,31.88 v19.94,31.88
TOUCH  (via drill 0.35)
  Top 0.152: PAD1.1 14.33,1.27 | PAD4.1 PAD3.1 21.58,1.28 13.97,1.28 | 13.97,1.28 12.92,1.28 14.33,1.27 | 14.33,1.27 PAD2.1 | 10.92,1.83 10.03,3.35 10.03,7.62 13.33,10.92 v13.33,11.05 | 10.92,1.83 10.93,1.81 | IC2.12 15.18,20.7 15.24,20.64 v15.24,19.81 | PAD1.1 13.96,1.27 13.97,1.28 | PAD1.1 10.36,1.27 10.92,1.83
  Bottom 0.152: v15.24,19.81 15.24,12.95 14.72,12.43 14.35,12.43 14,12.08 14,11.71 v13.33,11.05
  pour Top (isolate 0.254): 8,2.54 30.23,2.54 27.94,0 10.16,0
  pour Top (isolate 0.254): 29.97,44.45 9.02,44.45 11.3,46.99 27.81,46.99
TOUCH_  (via drill 0.35)  (5 unrouted)
  Top 0.152: 11.46,45.66 11.45,45.65 11.45,37.57 v12.19,36.83 | IC2.11 15.11,21.36 14.78,21.36 14.34,21.8 14.34,25.87 13.08,27.13 v13.08,27.3 13.13,27.26
  Bottom 0.152: v13.08,27.3 12.19,28.19 v12.19,36.83
VBAT  (via drill 0.35)
  Top 0.152: U1.6 v28.32,22.86 27.01,22.86 C13.1 | MCP73831T1.3 12.01,25 D2.A 12.11,26.02 v13.27,26.02 13.21,25.96 R6.2 | v21.34,23.62 19.68,25.27 v19.05,25.27
  Bottom 0.152: BATT.2 32.65,22.21 32,22.86 v28.32,22.86 25.4,22.86 24.64,23.62 v21.34,23.62 | v19.05,25.27 18.77,25.55 17.78,25.55 17.31,26.02 v13.27,26.02
VBUS  (via drill 0.35)
  Top 0.152: MCP73831T1.4 8.31,24.45 D2.C 7.22,26.18 6.86,25.82 v6.86,22.23 6.86,21.21 7.11,20.95 CHG2.A | R5.1 21.03,16.13 18.92,16.13 18.55,15.76 U3.1 17.97,14.85 C4.1 14.92,13.27 14.39,13.8 | 14.39,13.8 C5.1 | v11.05,14.1 11.35,13.8 14.39,13.8
  Bottom 0.152: USB.VBUS 6.83,22.2 v6.86,22.23 6.86,20.92 6.5,20.57 6.5,19.22 | 6.5,19.22 6.5,14.74 7.34,13.91 10.86,13.91 v11.05,14.1 | 6.56,19.16 6.5,19.22

### Text on the board
tNames: B | B | A | A